# EAGLE design SARduino_328 (EAGLE 5.10)
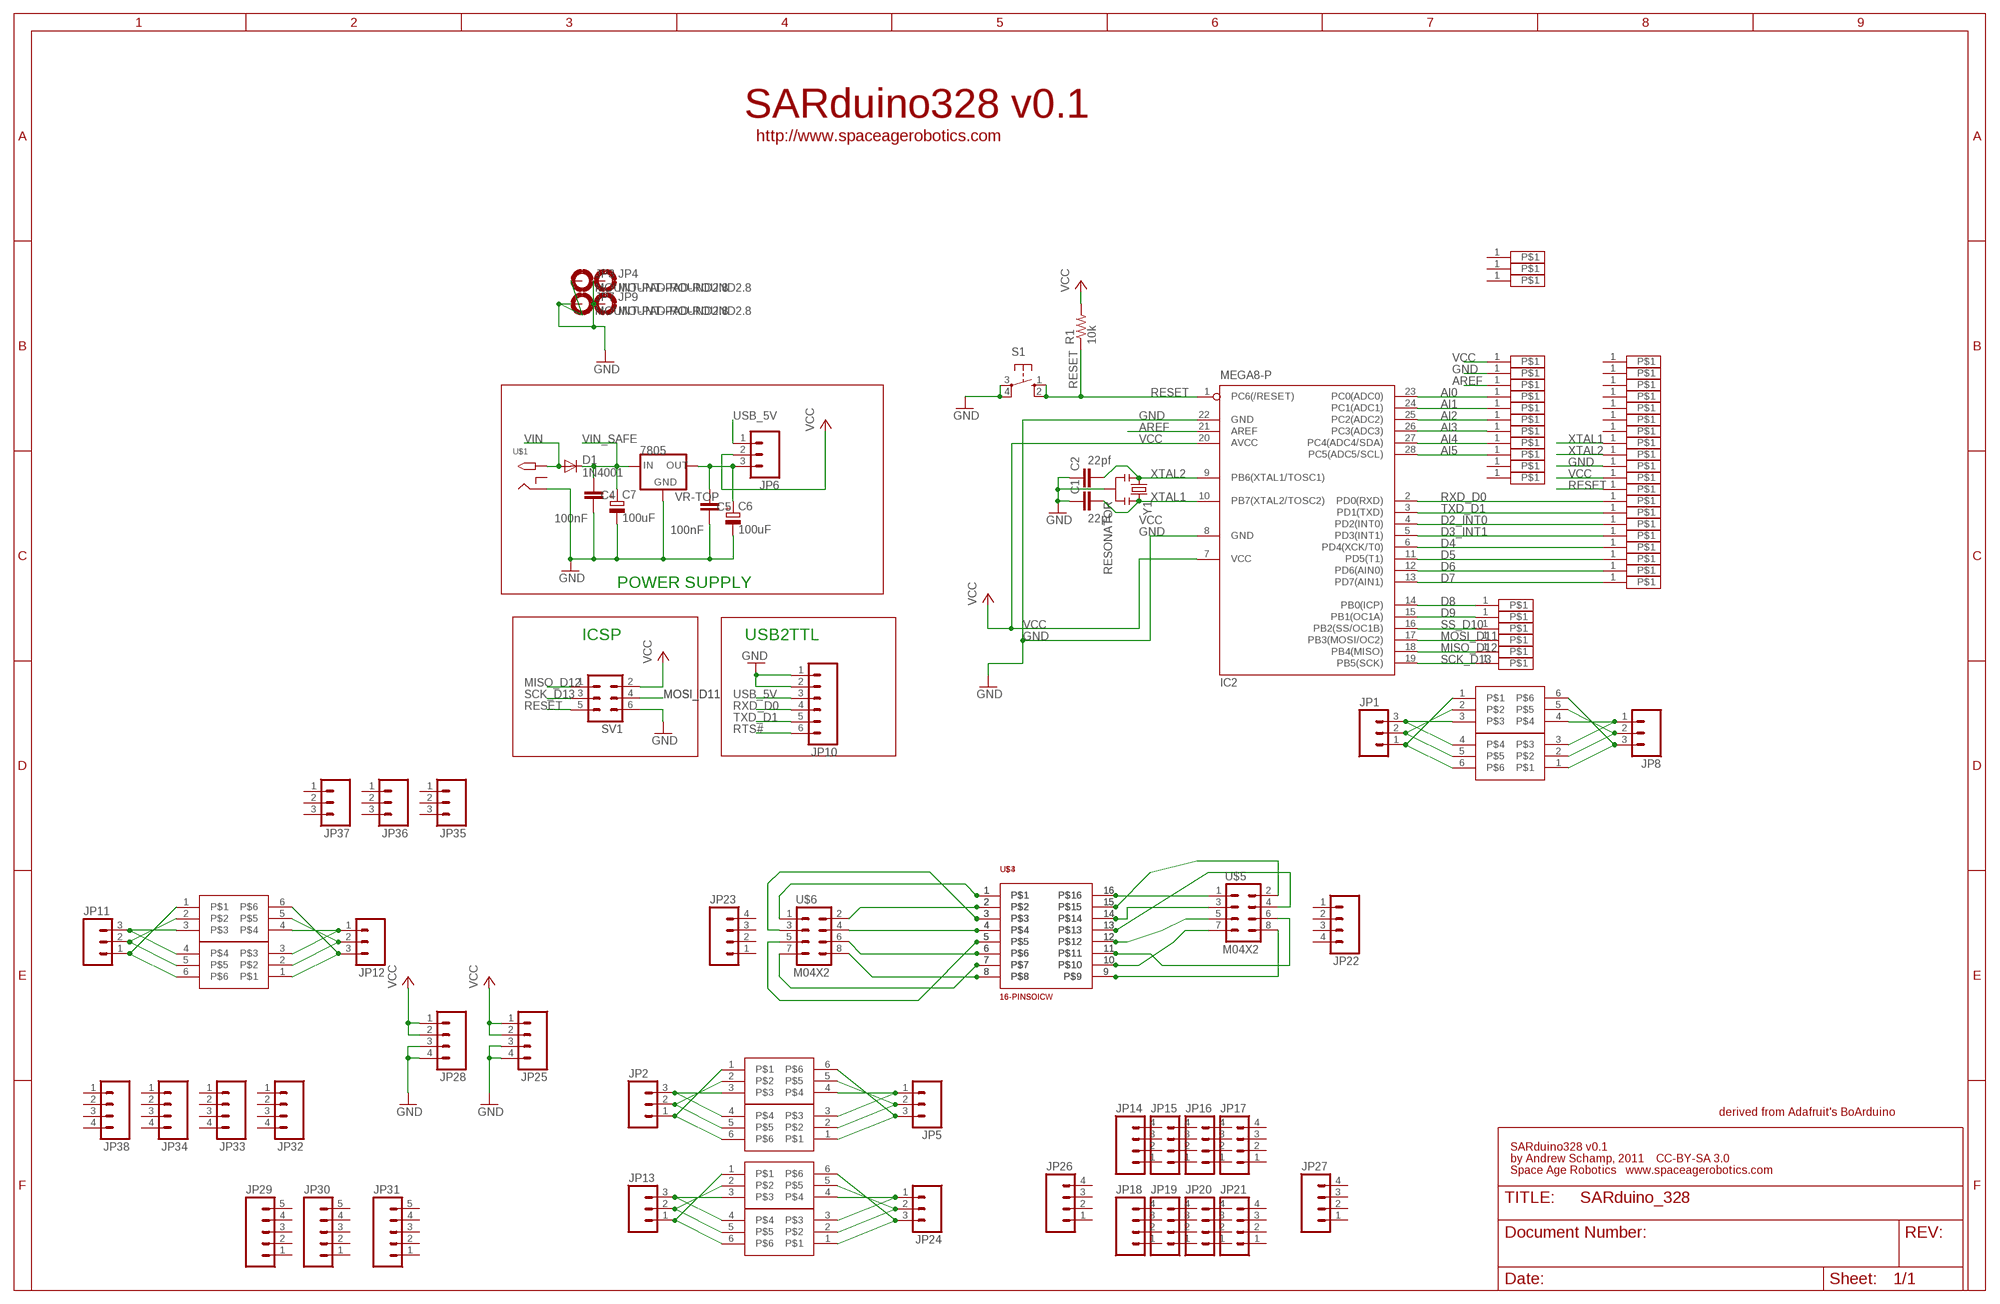
[diagram p0: schematic, sheet 1]

## Parts
C1  22pf  C-EU025-025X050  [C025-025X050]
C2  22pf  C-EU025-025X050  [C025-025X050]
C4  100nF  CAPPTH  [CAP-PTH-SMALL]
C5  100nF  CAPPTH  [CAP-PTH-SMALL]
C6  100uF  CPOL-EUE2.5-6  [E2,5-6]
C7  100uF  CPOL-EUE2.5-6  [E2,5-6]
D1  1N4001  1N4004  [DO41-10]
IC2  MEGA8-P  [DIL28-3]
JP1  M03PTH  [1X03]
JP2  M03PTH  [1X03]
JP3  MOUNT-PAD-ROUND2.8  [2,8-PAD]
JP4  MOUNT-PAD-ROUND2.8  [2,8-PAD]
JP5  M03PTH  [1X03]
JP6  M03PTH  [1X03]
JP7  MOUNT-PAD-ROUND2.8  [2,8-PAD]
JP8  M03PTH  [1X03]
JP9  MOUNT-PAD-ROUND2.8  [2,8-PAD]
JP10  M06LOCK  [1X06_LOCK]
JP11  M03PTH  [1X03]
JP12  M03PTH  [1X03]
JP13  M03PTH  [1X03]
JP14  M04PTH  [1X04]
JP15  M04PTH  [1X04]
JP16  M04PTH  [1X04]
JP17  M04PTH  [1X04]
JP18  M04PTH  [1X04]
JP19  M04PTH  [1X04]
JP20  M04PTH  [1X04]
JP21  M04PTH  [1X04]
JP22  M04PTH  [1X04]
JP23  M04PTH  [1X04]
JP24  M03PTH  [1X03]
JP25  M04PTH  [1X04]
JP26  M04PTH  [1X04]
JP27  M04PTH  [1X04]
JP28  M04PTH  [1X04]
JP29  M05PTH  [1X05]
JP30  M05PTH  [1X05]
JP31  M05PTH  [1X05]
JP32  M04PTH  [1X04]
JP33  M04PTH  [1X04]
JP34  M04PTH  [1X04]
JP35  M03PTH  [1X03]
JP36  M03PTH  [1X03]
JP37  M03PTH  [1X03]
JP38  M04PTH  [1X04]
R1  10k  R-US_0207/2V  [0207/2V]
S1  10-XX  [B3F-10XX]
SV1  ML6  [ML6]
U$1  2.1MMJACKTHM  [PJ-102A]
U$2  3-PIN-STRIP  [1X03-STRIP]
U$3  16-PINSOICW  [SO16W]
U$4  16-PINSOIC  [SO16]
U$5  M04X2  [2X4]
U$6  M04X2  [2X4]
U$7  6-PINSOT23-6  [SOT23-6L]
U$8  6-PINSC70-6  [SC70-6L]
U$9  3-PIN-STRIP  [1X03-STRIP]
U$10  3-PIN-STRIP  [1X03-STRIP]
U$11  3-PIN-STRIP  [1X03-STRIP]
U$12  3-PIN-STRIP  [1X03-STRIP]
U$13  3-PIN-STRIP  [1X03-STRIP]
U$14  3-PIN-STRIP  [1X03-STRIP]
U$15  3-PIN-STRIP  [1X03-STRIP]
U$16  3-PIN-STRIP  [1X03-STRIP]
U$17  3-PIN-STRIP  [1X03-STRIP]
U$18  3-PIN-STRIP  [1X03-STRIP]
U$19  3-PIN-STRIP  [1X03-STRIP]
U$20  3-PIN-STRIP  [1X03-STRIP]
U$21  3-PIN-STRIP  [1X03-STRIP]
U$22  3-PIN-STRIP  [1X03-STRIP]
U$23  3-PIN-STRIP  [1X03-STRIP]
U$24  3-PIN-STRIP  [1X03-STRIP]
U$25  3-PIN-STRIP  [1X03-STRIP]
U$26  3-PIN-STRIP  [1X03-STRIP]
U$27  3-PIN-STRIP  [1X03-STRIP]
U$28  3-PIN-STRIP  [1X03-STRIP]
U$29  3-PIN-STRIP  [1X03-STRIP]
U$30  3-PIN-STRIP  [1X03-STRIP]
U$31  3-PIN-STRIP  [1X03-STRIP]
U$32  3-PIN-STRIP  [1X03-STRIP]
U$33  3-PIN-STRIP  [1X03-STRIP]
U$34  3-PIN-STRIP  [1X03-STRIP]
U$35  3-PIN-STRIP  [1X03-STRIP]
U$36  3-PIN-STRIP  [1X03-STRIP]
U$37  3-PIN-STRIP  [1X03-STRIP]
U$38  3-PIN-STRIP  [1X03-STRIP]
U$39  3-PIN-STRIP  [1X03-STRIP]
U$40  3-PIN-STRIP  [1X03-STRIP]
U$41  3-PIN-STRIP  [1X03-STRIP]
U$42  3-PIN-STRIP  [1X03-STRIP]
U$43  3-PIN-STRIP  [1X03-STRIP]
U$44  3-PIN-STRIP  [1X03-STRIP]
U$45  3-PIN-STRIP  [1X03-STRIP]
U$46  3-PIN-STRIP  [1X03-STRIP]
U$47  3-PIN-STRIP  [1X03-STRIP]
U$48  6-PINSOT23-6  [SOT23-6L]
U$49  6-PINSC70-6  [SC70-6L]
U$50  6-PINSC70-6  [SC70-6L]
U$51  6-PINSC70-6  [SC70-6L]
U$52  6-PINSOT23-6  [SOT23-6L]
U$53  6-PINSOT23-6  [SOT23-6L]
VR-TOP  7805  V_REG_78XXSINK  [TO220-IGO]
Y1  RESONATOR  [RESONATOR/CRYSTAL_COMBO]

## Nets
AI0: IC2.23(PC0(ADC0)) U$15.1
AI1: IC2.24(PC1(ADC1)) U$14.1
AI2: IC2.25(PC2(ADC2)) U$13.1
AI3: IC2.26(PC3(ADC3)) U$12.1
AI4: IC2.27(PC4(ADC4/SDA)) U$10.1
AI5: IC2.28(PC5(ADC5/SCL)) U$11.1
AREF: IC2.21(AREF) U$16.1
D2_INT0: IC2.4(PD2(INT0)) U$42.1
D3_INT1: IC2.5(PD3(INT1)) U$43.1
D4: IC2.6(PD4(XCK/T0)) U$44.1
D5: IC2.11(PD5(T1)) U$45.1
D6: IC2.12(PD6(AIN0)) U$46.1
D7: IC2.13(PD7(AIN1)) U$47.1
D8: IC2.14(PB0(ICP)) U$19.1
D9: IC2.15(PB1(OC1A)) U$21.1
GND: C1.1 C2.1 C4.2 C5.2 C6.- C7.- IC2.8(GND) IC2.22(GND) JP3.B2,8(MOUNT) JP4.B2,8(MOUNT) JP7.B2,8(MOUNT) JP9.B2,8(MOUNT) JP10.1 JP10.2 JP25.3 JP25.4 JP28.3 JP28.4 S1.3(P) S1.4(P1) SV1.6 U$1.RING U$17.1 U$37.1 VR-TOP.GND Y1.2
MISO_D12: IC2.18(PB4(MISO)) SV1.1 U$20.1
MOSI_D11: IC2.17(PB3(MOSI/OC2)) SV1.4 U$25.1
N$1: JP1.3 U$8.4 U$49.3
N$2: JP1.2 U$8.5 U$49.2
N$3: JP1.1 U$8.6 U$49.1
N$4: JP2.3 U$7.3 U$48.4
N$5: JP2.2 U$7.2 U$48.5
N$6: JP2.1 U$7.1 U$48.6
N$7: JP5.1 U$7.4 U$48.3
N$8: JP5.2 U$7.5 U$48.2
N$9: JP5.3 U$7.6 U$48.1
N$10: JP8.1 U$8.3 U$49.4
N$11: U$3.16 U$4.16 U$5.1
N$12: U$3.15 U$4.15 U$5.2
N$13: JP8.2 U$8.2 U$49.5
N$14: U$3.5 U$4.5 U$6.5
N$15: U$3.1 U$4.1 U$6.1
N$16: JP8.3 U$8.1 U$49.6
N$17: JP11.3 U$50.4 U$51.3
N$18: JP11.2 U$50.5 U$51.2
N$19: JP11.1 U$50.6 U$51.1
N$20: JP12.1 U$50.3 U$51.4
N$21: U$3.14 U$4.14 U$5.3
N$22: U$3.13 U$4.13 U$5.4
N$23: U$3.12 U$4.12 U$5.5
N$24: U$3.11 U$4.11 U$5.6
N$25: U$3.10 U$4.10 U$5.7
N$26: U$3.9 U$4.9 U$5.8
N$27: U$3.8 U$4.8 U$6.8
N$28: U$3.7 U$4.7 U$6.7
N$29: U$3.6 U$4.6 U$6.6
N$30: JP12.2 U$50.2 U$51.5
N$31: U$3.4 U$4.4 U$6.4
N$32: U$3.3 U$4.3 U$6.3
N$33: U$3.2 U$4.2 U$6.2
N$34: JP12.3 U$50.1 U$51.6
N$35: JP13.3 U$52.3 U$53.4
N$36: JP13.2 U$52.2 U$53.5
N$37: JP13.1 U$52.1 U$53.6
N$38: JP24.1 U$52.4 U$53.3
N$39: JP24.2 U$52.5 U$53.2
N$40: JP24.3 U$52.6 U$53.1
RESET: IC2.1(PC6(/RESET)) R1.1 S1.1(S) S1.2(S1) SV1.5 U$39.1
RTS#: JP10.6
RXD_D0: IC2.2(PD0(RXD)) JP10.4 U$40.1
SCK_D13: IC2.19(PB5(SCK)) SV1.3 U$23.1
SS_D10: IC2.16(PB2(SS/OC1B)) U$22.1
TXD_D1: IC2.3(PD1(TXD)) JP10.5 U$41.1
USB_5V: JP6.1 JP10.3
VCC [power]: IC2.7(VCC) IC2.20(AVCC) JP6.2 JP25.1 JP25.2 JP28.1 JP28.2 R1.2 SV1.2 U$18.1 U$38.1
VIN [power]: D1.A U$1.TIP
VIN_SAFE [power]: C4.1 C7.+ D1.C VR-TOP.IN
VREG-OUT: C5.1 C6.+ JP6.3 VR-TOP.OUT
XTAL1: C1.2 IC2.10(PB7(XTAL2/TOSC2)) U$35.1 Y1.3
XTAL2: C2.2 IC2.9(PB6(XTAL1/TOSC1)) U$36.1 Y1.1
Unconnected: JP14.1 JP14.2 JP14.3 JP14.4 JP15.1 JP15.2 JP15.3 JP15.4 JP16.1 JP16.2 JP16.3 JP16.4 JP17.1 JP17.2 JP17.3 JP17.4 JP18.1 JP18.2 JP18.3 JP18.4 JP19.1 JP19.2 JP19.3 JP19.4 JP20.1 JP20.2 JP20.3 JP20.4 JP21.1 JP21.2 JP21.3 JP21.4 JP22.1 JP22.2 JP22.3 JP22.4 JP23.1 JP23.2 JP23.3 JP23.4 JP26.1 JP26.2 JP26.3 JP26.4 JP27.1 JP27.2 JP27.3 JP27.4 JP29.1 JP29.2 JP29.3 JP29.4 JP29.5 JP30.1 JP30.2 JP30.3 JP30.4 JP30.5 JP31.1 JP31.2 JP31.3 JP31.4 JP31.5 JP32.1 JP32.2 JP32.3 JP32.4 JP33.1 JP33.2 JP33.3 JP33.4 JP34.1 JP34.2 JP34.3 JP34.4 JP35.1 JP35.2 JP35.3 JP36.1 JP36.2 JP36.3 JP37.1 JP37.2 JP37.3 JP38.1 JP38.2 JP38.3 JP38.4 U$1.RING_SW U$2.1 U$9.1 U$24.1 U$26.1 U$27.1 U$28.1 U$29.1 U$30.1 U$31.1 U$32.1 U$33.1 U$34.1

## Notes on the sheet
- SARduino328 v0.1
- http://www.spaceagerobotics.com
- POWER SUPPLY
- ICSP | USB2TTL
- derived from Adafruit's BoArduino
- SARduino328 v0.1
- by Andrew Schamp, 2011    CC-BY-SA 3.0
- Space Age Robotics   www.spaceagerobotics.com

## Library data of the parts
C1 C2 = rcl:C-EU: CAPACITOR, European symbol
C4 C5 = ideabot:CAP: Capacitor Standard 0603 ceramic capacitor, and 0.1" leaded capacitor.
C6 C7 = rcl:CPOL-EU: POLARIZED CAPACITOR, European symbol
D1 = diode:1N4004: DIODE general purpose rectifier, 1 A
IC2 = atmel:MEGA8-P: MICROCONTROLLER 8 Kbytes FLASH, 1 kbytes SRAM, 512 bytes EEPROM, USART, 4-channel 10 bit ADC, 2-channel 8 bit ADC Pin compatible with Atmega48, ATMega88, ATMega168 Source: avr.lbr
JP1 JP2 JP5 JP6 JP8 JP11-JP13 JP24 JP35-JP37 = SparkFun:M03: Header 3 Standard 3-pin 0.1" header. Use with straight break away headers (SKU : PRT-00116), right angle break away headers (PRT-00553), swiss pins (PRT-00743), machine pins (PRT-00117), and female headers (PRT-00115). Molex polarized connector foot print use with SKU : PRT-08232 with associated crimp pins and housings.
JP3 JP4 JP7 JP9 = holes:MOUNT-PAD-ROUND: MOUNTING PAD, round
JP10 = SparkFun:M06: Header 6 Standard 6-pin 0.1" header. Use with straight break away headers (SKU : PRT-00116), right angle break away headers (PRT-00553), swiss pins (PRT-00743), machine pins (PRT-00117), and female headers (PRT-00115). Molex polarized connector foot print use with SKU : PRT-08094 with associated crimp pins and housings. NOTES ON THE VARIANTS LOCK and LOCK_LONGPADS... This footprint was designed to help hold the alignment of a through-hole component (i.e. 6-pin header) while soldering it into place. You may notice that each hole has been shifted either up or down by 0.005 of an inch from it's more standard position (which is a perfectly straight line). This slight alteration caused the pins (the squares in the middle) to touch the edges of the holes. Because they are alternating, it causes a "brace" to hold the component in place. 0.005 has proven to be the perfect amount of "off-center" position when using our standard breakaway headers. Although looks a little odd when you look at the bare footprint, once you have a header in there, the alteration is very hard to notice. Also, if you push a header all the way into place, it is covered up entirely on the bottom side. This idea of altering the position of holes to aid alignment will be further integrated into the Sparkfun Library for other footprints. It can help hold any component with 3 or more connection pins.
JP14-JP23 JP25-JP28 JP32-JP34 JP38 = SparkFun:M04: Header 4 Standard 4-pin 0.1" header. Use with straight break away headers (SKU : PRT-00116), right angle break away headers (PRT-00553), swiss pins (PRT-00743), machine pins (PRT-00117), and female headers (PRT-00115). Molex polarized connector foot print use with SKU : PRT-08231 with associated crimp pins and housings. 1MM SMD Version SKU: PRT-10208
JP29-JP31 = SparkFun:M05: Header 5 Standard 5-pin 0.1" header. Use with straight break away headers (SKU : PRT-00116), right angle break away headers (PRT-00553), swiss pins (PRT-00743), machine pins (PRT-00117), and female headers (PRT-00115). Molex polarized connector foot print use with SKU : PRT-08230 with associated crimp pins and housings.
R1 = adafruit:R-US_: RESISTOR, American symbol
S1 = switch-omron:10-XX: OMRON SWITCH
SV1 = con-harting-ml:ML6: HARTING
U$1 = adafruit:2.1MMJACK: 2.1mm x 5.5mm THM DC jack with internal switch. Digikey part #PJ-102A, 4UCON part #05537 2.1mm x 5.5mm SMT DC jack with internal switch. Digikey part #PJ-002A-SMT, 4UCON part #03267 By microbuilder.eu & adafruit.com
U$2 U$9-U$47 = ideabot:3-PIN-STRIP
U$3 U$4 = ideabot:16-PIN
U$5 U$6 = SparkFun:M04X2
U$7 U$8 U$48-U$53 = ideabot:6-PIN
VR-TOP = SparkFun:V_REG_78XX: Voltage Regulator Standard 7805 5V regulator. IGO (Input Ground Output). Spark Fun Electronics SKU : COM-00107
Y1 = ideabot:RESONATOR: Resonator Small SMD resonator. This is the itty bitty 10/20MHz resonators with built in caps. CSTCE10M0G55 and CSTCE20M0V53. Footprint has been reviewed closely but hasn't been tested yet.

## Net classes
0 default: width 0.254 mm, clearance 0.152 mm
1 power: width 0.305 mm, clearance 0.152 mm

## Board
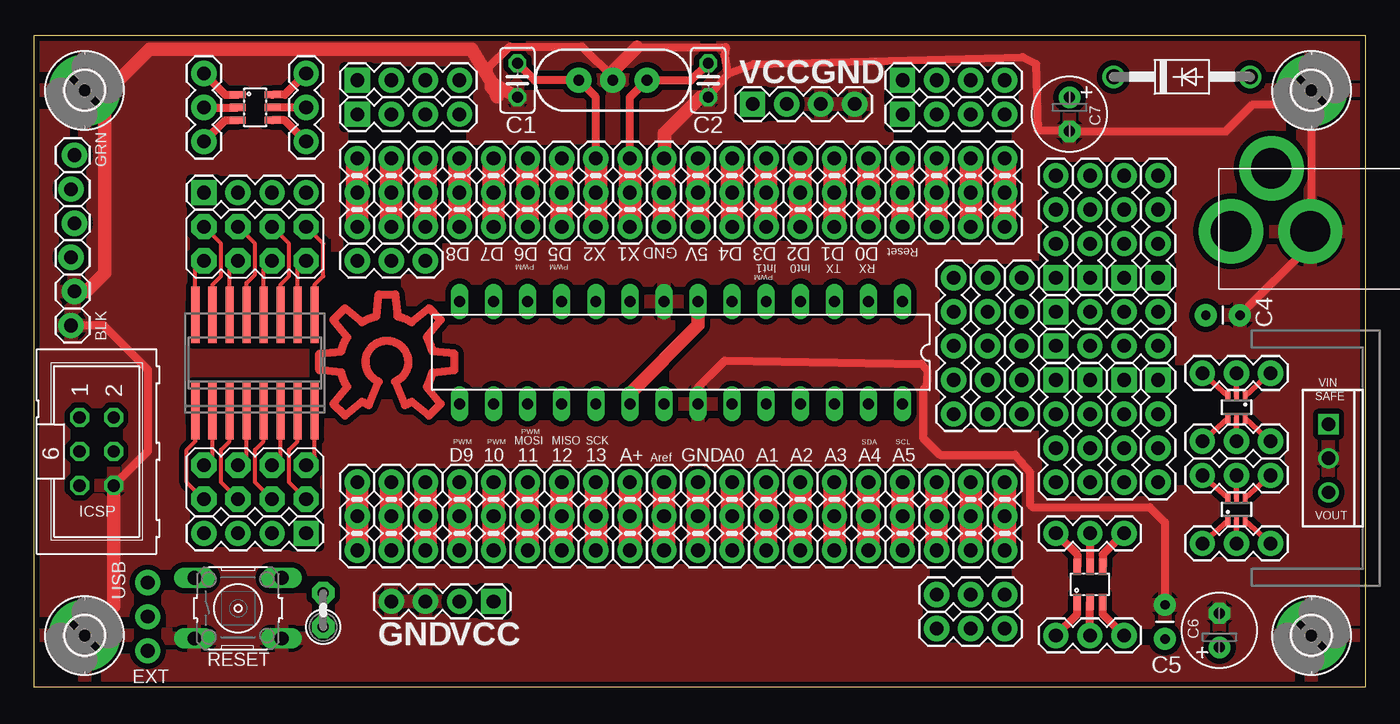
[diagram p1: board, top side]
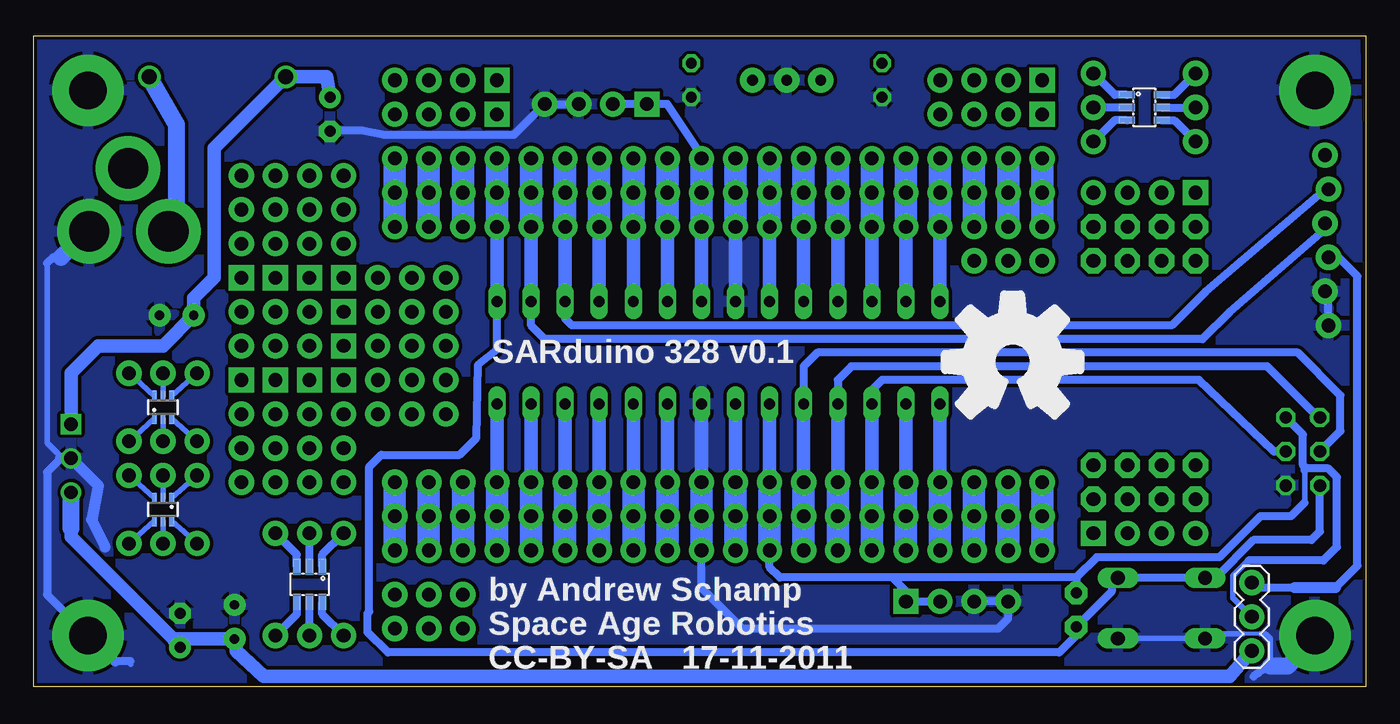
[diagram p2: board, bottom side, seen from below]

Size 99.31 x 48.51 mm. Coordinates in mm from the lower left corner, seen from the top.
Outline: 0,0 99.31,0 99.31,48.51 0,48.51 0,0
Copper layers (1*16): Top 0.035mm / dielectric 1.5mm / Bottom 0.035mm
Design rules "ITead_rule": minimum track width 6mil, minimum drill 12mil, track to track 6mil, track to pad 6mil, pad to pad 6mil, via to via 6mil, smd to smd 0mil, copper to edge 10mil, drill to drill 10mil, minimum pad ring 10mil, minimum via ring 6mil, stop-mask expansion 2mil, vias tented up to drill 100mil, thermal gap 10mil

### Footprints (pad centres in the part's own frame; a part is rotated, then mirrored left to right if it is on the bottom)
C025-025X050 = drill 0.813 octagon: 1 -1.27,0; 2 1.27,0
CAP-PTH-SMALL = drill 0.7 pad 1.651 round: 1 0,0; 2 2.54,0
E2,5-6 = drill 0.813 pad 1.6 round: + -1.27,0 | drill 0.813 pad 1.6 octagon: - 1.27,0
DO41-10 = drill 1.118 round: A 5.08,0; C -5.08,0
DIL28-3 = drill 0.813 long: 1 -16.51,-3.81; 2 -13.97,-3.81; 3 -11.43,-3.81; 4 -8.89,-3.81; 5 -6.35,-3.81; 6 -3.81,-3.81; 7 -1.27,-3.81; 8 1.27,-3.81; 9 3.81,-3.81; 10 6.35,-3.81; 11 8.89,-3.81; 12 11.43,-3.81; 13 13.97,-3.81; 14 16.51,-3.81; 15 16.51,3.81; 16 13.97,3.81; 17 11.43,3.81; 18 8.89,3.81; 19 6.35,3.81; 20 3.81,3.81; 21 1.27,3.81; 22 -1.27,3.81; 23 -3.81,3.81; 24 -6.35,3.81; 25 -8.89,3.81; 26 -11.43,3.81; 27 -13.97,3.81; 28 -16.51,3.81
1X03 = drill 1.016 pad 1.88 round: 1 0,0; 2 2.54,0; 3 5.08,0
2,8-PAD = drill 2.8 pad 5.334 round: B2,8 0,0
1X06_LOCK = drill 1.016 pad 1.88 round: 1 0,0; 2 2.54,-0.254; 3 5.08,0; 4 7.62,-0.254; 5 10.16,0; 6 12.7,-0.254
1X04 = drill 1.016 pad 1.88 square: 1 0,0 | drill 1.016 pad 1.88 round: 2 2.54,0; 3 5.08,0; 4 7.62,0
1X05 = drill 1.016 pad 1.88 round: 1 0,0; 2 2.54,0; 3 5.08,0; 4 7.62,0; 5 10.16,0
0207/2V = drill 0.813 pad 1.676 octagon: 1 -1.27,0; 2 1.27,0
B3F-10XX = drill 1.016 long: 1 -3.251,2.261; 2 3.251,2.261; 3 -3.251,-2.261; 4 3.251,-2.261
ML6 = drill 0.914 octagon: 1 -2.54,-1.27; 2 -2.54,1.27; 3 0,-1.27; 4 0,1.27; 5 2.54,-1.27; 6 2.54,1.27
PJ-102A = drill 3 pad 4.8 round: RING 0.1,-3.39; RING_SW -4.6,-6.29; TIP 0.1,-9.29
1X03-STRIP = drill 1.016 pad 1.88 round: 1 0,0; 2 2.54,0; 3 5.08,0
SO16W = smd 0.6 x 2.2: 1 -4.445,-4.6; 2 -3.175,-4.6; 3 -1.905,-4.6; 4 -0.635,-4.6; 5 0.635,-4.6; 6 1.905,-4.6; 7 3.175,-4.6; 8 4.445,-4.6; 9 4.445,4.6; 10 3.175,4.6; 11 1.905,4.6; 12 0.635,4.6; 13 -0.635,4.6; 14 -1.905,4.6; 15 -3.175,4.6; 16 -4.445,4.6
SO16 = smd 0.6 x 2.2: 1 -4.445,-2.6; 2 -3.175,-2.6; 3 -1.905,-2.6; 4 -0.635,-2.6; 5 0.635,-2.6; 6 1.905,-2.6; 7 3.175,-2.6; 8 4.445,-2.6; 9 4.445,2.6; 10 3.175,2.6; 11 1.905,2.6; 12 0.635,2.6; 13 -0.635,2.6; 14 -1.905,2.6; 15 -3.175,2.6; 16 -4.445,2.6
2X4 = drill 1.016 pad 1.88 octagon: 1 -3.81,-1.27; 2 -3.81,1.27; 3 -1.27,-1.27; 4 -1.27,1.27; 5 1.27,-1.27; 6 1.27,1.27; 7 3.81,-1.27; 8 3.81,1.27
SOT23-6L = smd 0.55 x 1.2: 1 -0.95,-1.3; 2 0,-1.3; 3 0.95,-1.3; 4 0.95,1.3; 5 0,1.3; 6 -0.95,1.3
SC70-6L = smd 0.35 x 0.8: 1 -0.65,-0.85; 2 0,-0.85; 3 0.65,-0.85; 4 0.65,0.85; 5 0,0.85; 6 -0.65,0.85
TO220-IGO = drill 1 round: GND 0,0; OUT 2.54,0 | drill 1 square: IN -2.54,0
RESONATOR/CRYSTAL_COMBO = drill 0.8 pad 1.88 round: 1 -2.54,0; 2 0,0; 3 2.54,0

### Placement (x,y rotation side)
C1  36.07,45.21 90 top
C2  50.29,45.21 90 top
C4  87.38,27.69 0 top
C5  84.33,3.56 90 top
C6  88.39,4.19 90 top
C7  77.22,42.67 270 top
D1  85.6,45.47 0 top
IC2  48.26,24.89 180 top
JP1  87.12,15.75 0 top
JP2  20.32,45.72 270 top
JP3  3.81,3.81 0 top
JP4  95.25,3.81 0 top
JP5  12.7,40.64 90 top
JP6  8.51,7.75 270 bottom
JP7  3.81,44.45 0 top
JP8  92.2,10.67 180 top
JP9  95.25,44.45 0 top
JP10  2.79,26.92 90 top
JP11  92.2,18.29 180 top
JP12  87.12,23.37 0 top
JP13  76.2,11.43 0 top
JP14  76.2,30.48 90 top
JP15  78.74,30.48 90 top
JP16  81.28,30.48 90 top
JP17  83.82,30.48 90 top
JP18  76.2,22.86 270 top
JP19  78.74,22.86 270 top
JP20  81.28,22.86 270 top
JP21  83.82,22.86 270 top
JP22  12.7,36.83 0 top
JP23  20.32,11.43 180 top
JP24  81.28,3.81 180 top
JP25  34.29,6.35 180 top
JP26  76.2,27.94 0 top
JP27  76.2,25.4 0 top
JP28  53.59,43.43 0 top
JP29  73.66,20.32 90 top
JP30  71.12,20.32 90 top
JP31  68.58,20.32 90 top
JP32  24.13,42.67 0 top
JP33  24.13,45.21 0 top
JP34  64.77,42.67 0 top
JP35  67.31,6.86 0 top
JP36  67.31,4.32 0 top
JP37  24.13,31.75 0 top
JP38  64.77,45.21 0 top
R1  21.59,5.71 90 top
S1  15.24,5.84 0 top
SV1  4.7,17.53 270 top
U$1  98.55,34.04 270 top
U$2  24.13,34.29 90 top
U$3  16.51,24.13 0 top
U$4  16.51,24.13 0 top
U$5  16.51,33.02 0 top
U$6  16.51,15.24 0 top
U$7  16.51,43.18 270 bottom
U$8  89.66,13.21 0 top
U$9  26.67,34.29 90 top
U$10  62.23,15.24 270 top
U$11  64.77,15.24 270 top
U$12  59.69,15.24 270 top
U$13  57.15,15.24 270 top
U$14  54.61,15.24 270 top
U$15  52.07,15.24 270 top
U$16  46.99,15.24 270 top
U$17  46.99,34.29 90 top
U$18  49.53,34.29 90 top
U$19  31.75,34.29 90 top
U$20  39.37,15.24 270 top
U$21  31.75,15.24 270 top
U$22  34.29,15.24 270 top
U$23  41.91,15.24 270 top
U$24  72.39,15.24 270 top
U$25  36.83,15.24 270 top
U$26  67.31,34.29 90 top
U$27  69.85,34.29 90 top
U$28  72.39,34.29 90 top
U$29  69.85,15.24 270 top
U$30  67.31,15.24 270 top
U$31  24.13,15.24 270 top
U$32  29.21,34.29 90 top
U$33  29.21,15.24 270 top
U$34  26.67,15.24 270 top
U$35  41.91,34.29 90 top
U$36  44.45,34.29 90 top
U$37  49.53,15.24 270 top
U$38  44.45,15.24 270 top
U$39  64.77,34.29 90 top
U$40  62.23,34.29 90 top
U$41  59.69,34.29 90 top
U$42  57.15,34.29 90 top
U$43  54.61,34.29 90 top
U$44  52.07,34.29 90 top
U$45  39.37,34.29 90 top
U$46  36.83,34.29 90 top
U$47  34.29,34.29 90 top
U$48  16.51,43.18 270 top
U$49  89.66,13.21 180 bottom
U$50  89.66,20.83 180 top
U$51  89.66,20.83 0 bottom
U$52  78.74,7.62 180 bottom
U$53  78.74,7.62 0 top
VR-TOP  96.52,17.02 270 top
Y1  43.18,45.21 180 top

### Tracks (layer width: path | path; a pad name or v marks a point on that pad's centre or on a via)
AI0
  Bottom 1.016: U$15.1 IC2.23
AI1
  Bottom 1.016: U$14.1 IC2.24
AI2
  Bottom 1.016: U$13.1 IC2.25
AI3
  Bottom 1.016: U$12.1 IC2.26
AI4
  Bottom 1.016: U$10.1 IC2.27
AI5
  Bottom 1.016: U$11.1 IC2.28
AREF
  Bottom 1.016: U$16.1 IC2.21
D2_INT0
  Bottom 1.016: IC2.4 U$42.1
D3_INT1
  Bottom 1.016: IC2.5 U$43.1
D4
  Bottom 1.016: IC2.6 U$44.1 52.07,34.8
D5
  Bottom 1.016: IC2.11 U$45.1
D6
  Bottom 1.016: IC2.12 U$46.1
D7
  Bottom 1.016: IC2.13 U$47.1
D8
  Bottom 1.016: IC2.14 U$19.1
D9
  Bottom 1.016: U$21.1 IC2.15
GND
  Top 0.61: JP10.1 5.23,26.92 8.53,23.62 8.53,17.55 SV1.6 | 44.98,47.68 51.61,47.68 51.49,47.04 51.74,45.64 | 51.74,45.64 C2.1 | Y1.2 43.18,45.44 40.89,47.73 35.48,47.73 33.96,46.2 33.96,44.55 34.54,43.97 | 51.74,45.64 53.7,46.41 73.74,46.94 74.73,46.43 74.85,41.48 77.14,41.48 C7.- 88.88,41.4 90.88,43.41 94.21,43.41 JP9.B2,8 95.25,34.02 U$1.RING 95.16,32.93 C4.2 | IC2.22 49.53,22.3 51.54,24.31 66.19,24.05 66.62,23.55 66.55,22.35 66.29,22.1 66.29,18.54 67.56,17.27 73.15,17.27 74.27,15.98 74.27,13.56 74.47,13.36 83.21,13.36 84.33,12.24 C5.2
  Top 1.016: SV1.6 5.97,5.97 JP3.B2,8 | JP10.2 3.94,29.46 5.31,30.84 5.31,42.95 JP7.B2,8 5.59,44.45 8.66,47.52 32.66,47.52 34.19,44.98 | 34.19,44.98 34.54,43.97 | 34.19,44.98 36.04,43.97 C1.1 | C2.1 49.71,43.94 47.02,41.25 47.02,34.31 U$17.1 | Y1.2 43.18,45.87 44.98,47.68
  Bottom 0.305: 7.87,3.94 9.14,3.94
  Bottom 0.406: 8,1.02 7.11,1.4 7.11,1.52 7.11,3.56 7.49,3.94 7.87,3.94 | 9.14,3.94 11.63,3.94 S1.3 S1.4 | 92.08,1.91 92.08,1.65 | 97.16,17.02 97.41,17.02 | 97.16,17.02 VR-TOP.GND | 97.16,17.02 98.3,18.16 98.3,31.56
  Bottom 0.61: 97.28,32 97.86,32 98.3,31.56 | 8,1.02 8.38,0.76 | 92.08,1.91 93.34,1.91 JP4.B2,8 | JP10.1 2.79,29.21 JP10.2 | 97.41,17.02 97.41,16.89 98.3,16 98.3,6.86 JP4.B2,8 | JP4.B2,8 93.22,1.78 | JP25.3 JP25.4 26.67,5.08 27.43,4.32 46.48,4.32 49.53,7.37 U$37.1 | JP28.3 JP28.4 63.5,41.15 73.15,41.15 74.85,41.48 77.14,41.48 C7.-
  Bottom 0.813: 93.98,10.41 95,12.45 94.49,14.99 VR-TOP.GND
  Bottom 1.016: U$37.1 IC2.22 | U$17.1 IC2.8
  Bottom 1.27: JP3.B2,8 3.81,3.56 5.84,1.52 7.11,1.52 | U$1.RING 95.67,33.62 97.28,32
  pour Bottom (isolate 0.254): 0.89,49.66 -0.25,-0.25 99.57,-4.32 99.31,51.31
  pour Top (isolate 0.406): 0.25,-0.25 55.63,-2.03 101.19,-0.76 101.78,51.13 0.71,50.57
MISO_D12
  Bottom 0.61: 3.56,20.07 7.37,23.88 38.35,23.88 39.37,22.86 IC2.18
  Bottom 1.016: IC2.18 U$20.1
  Bottom 1.27: SV1.1 3.56,20.07
MOSI_D11
  Bottom 0.61: SV1.4 6.86,17.53 12.45,22.86 36.07,22.86 36.83,22.1 IC2.17
  Bottom 1.016: IC2.17 U$25.1
N$1
  Top 0.406: JP1.3 U$49.3
  Bottom 0.406: U$49.3 JP1.3
N$2
  Top 0.406: JP1.2 U$49.2
  Bottom 0.406: U$49.2 JP1.2
N$3
  Top 0.406: JP1.1 U$49.1
  Bottom 0.406: U$49.1 JP1.1
N$4
  Top 0.61: U$7.3 18.73,42.23 JP2.3
  Bottom 0.61: U$7.3 18.73,42.23 JP2.3
N$5
  Top 0.61: JP2.2 U$7.2
  Bottom 0.61: U$7.2 JP2.2
N$6
  Top 0.61: U$7.1 18.73,44.13 JP2.1
  Bottom 0.61: U$7.1 18.73,44.13 JP2.1
N$7
  Top 0.61: U$7.4 14.29,42.23 JP5.1
  Bottom 0.61: U$7.4 14.29,42.23 JP5.1
N$8
  Top 0.61: JP5.2 U$7.5
  Bottom 0.61: U$7.5 JP5.2
N$9
  Top 0.61: U$7.6 14.29,44.13 JP5.3
  Bottom 0.61: U$7.6 14.29,44.13 JP5.3
N$10
  Top 0.406: JP8.1 U$49.4
  Bottom 0.406: U$49.4 JP8.1
N$11
  Top 0.305: U$5.1 12.06,31.11 U$3.16
  Top 0.61: U$4.16 U$3.16
N$12
  Top 0.305: U$3.15 13.34,29.97 13.97,30.61 13.97,33.02 U$5.2
  Top 0.61: U$4.15 U$3.15
N$13
  Top 0.406: JP8.2 U$49.5
  Bottom 0.406: U$49.5 JP8.2
N$14
  Top 0.305: U$3.5 17.14,18.29 16.51,17.65 16.51,15.24 U$6.5
  Top 0.61: U$3.5 U$4.5
N$15
  Top 0.305: U$3.1 12.06,18.29 11.43,17.65 11.43,15.24 U$6.1
  Top 0.61: U$3.1 U$4.1
N$16
  Top 0.406: JP8.3 U$49.6
  Bottom 0.406: JP8.3 U$49.6
N$17
  Top 0.406: JP11.3 U$51.3
  Bottom 0.406: JP11.3 U$51.3
N$18
  Top 0.406: JP11.2 U$51.2
  Bottom 0.406: U$51.2 JP11.2
N$19
  Top 0.406: JP11.1 U$51.1
  Bottom 0.406: U$51.1 JP11.1
N$20
  Top 0.406: JP12.1 U$51.4
  Bottom 0.406: U$51.4 JP12.1
N$21
  Top 0.305: U$3.14 14.61,31.11 U$5.3
  Top 0.61: U$4.14 U$3.14
N$22
  Top 0.305: U$5.4 16.51,33.02 16.51,30.73 15.88,30.1 U$3.13
  Top 0.61: U$4.13 U$3.13
N$23
  Top 0.305: U$3.12 17.14,31.11 U$5.5
  Top 0.61: U$4.12 U$3.12
N$24
  Top 0.305: U$5.6 19.05,33.02 19.05,30.61 18.41,29.97 U$3.11
  Top 0.61: U$4.11 U$3.11
N$25
  Top 0.305: U$3.10 19.68,31.11 U$5.7
  Top 0.61: U$4.10 U$3.10
N$26
  Top 0.305: U$5.8 21.59,33.02 21.59,30.61 20.95,29.97 U$3.9
  Top 0.61: U$4.9 U$3.9
N$27
  Top 0.305: U$3.8 20.95,17.14 U$6.8
  Top 0.61: U$3.8 U$4.8
N$28
  Top 0.305: U$3.7 19.68,18.29 19.05,17.65 19.05,15.24 U$6.7
  Top 0.61: U$3.7 U$4.7
N$29
  Top 0.305: U$3.6 18.41,17.14 U$6.6
  Top 0.61: U$3.6 U$4.6
N$30
  Top 0.406: JP12.2 U$51.5
  Bottom 0.406: U$51.5 JP12.2
N$31
  Top 0.305: U$3.4 15.88,17.14 U$6.4
  Top 0.61: U$3.4 U$4.4
N$32
  Top 0.305: U$3.3 14.61,18.29 13.97,17.65 13.97,15.24 U$6.3
  Top 0.61: U$3.3 U$4.3
N$33
  Top 0.305: U$3.2 13.34,17.14 U$6.2
  Top 0.61: U$3.2 U$4.2
N$34
  Top 0.406: JP12.3 U$51.6
  Bottom 0.406: U$51.6 JP12.3
N$35
  Top 0.61: U$52.3 79.69,9.84 JP13.3
  Bottom 0.61: U$52.3 79.69,9.84 JP13.3
N$36
  Top 0.61: JP13.2 U$52.2
  Bottom 0.61: U$52.2 JP13.2
N$37
  Top 0.61: U$52.1 77.79,9.84 JP13.1
  Bottom 0.61: U$52.1 77.79,9.84 JP13.1
N$38
  Top 0.61: U$52.4 79.69,5.4 JP24.1
  Bottom 0.61: U$52.4 79.69,5.4 JP24.1
N$39
  Top 0.61: JP24.2 U$52.5
  Bottom 0.61: JP24.2 U$52.5
N$40
  Top 0.61: U$52.6 77.79,5.4 JP24.3
  Bottom 0.61: U$52.6 77.79,5.4 JP24.3
N$41
  Top 0.61: 27.68,20.98 arc9 28.19,21.24 29.47,20.2 30.34,21.08 29.3,22.36 arc19 29.74,23.42 31.38,23.59 31.38,24.82 29.74,24.99 arc19 29.3,26.06 30.34,27.33 29.47,28.21 28.19,27.17 arc19 27.12,27.61 26.96,29.25 25.72,29.25 25.55,27.61 arc19 24.49,27.17 23.21,28.21 22.34,27.33 23.38,26.06 arc19 22.94,24.99 21.3,24.82 21.3,23.59 22.94,23.42 arc19 23.38,22.36 22.34,21.08 23.21,20.2 24.49,21.24 arc9 25,20.98 25.73,22.74 arc-68 24.75,24.21 arc-248 26.95,22.74 27.68,20.98
RESET
  Bottom 0.406: S1.2 18.95,8.1 | 11.2,8.1 S1.1
  Bottom 0.61: S1.1 S1.2 | 11.2,8.1 8.38,10.92 4.06,10.92 3.43,11.56 SV1.5 | 18.95,8.1 18.95,7.09 R1.1 21.59,3.81 22.86,2.54 72.9,2.54 74.42,4.06 74.42,5.46 74.3,5.59 74.3,16.38 73.41,17.27 67.56,17.27 66.29,18.54 66.17,24 64.77,25.15 IC2.1
  Bottom 1.016: IC2.1 U$39.1
RXD_D0
  Bottom 0.61: JP10.4 2.79,34.29 10.16,27.94 12.19,25.91 61.21,25.91 62.23,26.92 IC2.2
  Bottom 1.016: IC2.2 U$40.1
SCK_D13
  Bottom 0.61: SV1.3 1.91,19.05 1.91,21.72 5.08,24.89 40.89,24.89 41.91,23.88 IC2.19
  Bottom 1.016: IC2.19 U$23.1
SS_D10
  Bottom 1.016: U$22.1 IC2.16
TXD_D1
  Bottom 0.61: JP10.5 3.05,36.83 3.3,36.83 11.94,29.46 14.48,26.92 59.18,26.92 59.69,27.43 IC2.3
  Bottom 1.016: IC2.3 U$41.1
USB_5V
  Bottom 0.406: 8.13,7.37 JP6.1
  Bottom 0.61: 5.33,7.37 8.13,7.37 | 2.29,7.37 0.64,9.02 0.64,30.61 2.03,32 JP10.3
  Bottom 0.813: 2.29,7.37 5.33,7.37
VCC
  Top 1.016: IC2.20 44.45,21.87 49.53,26.95 IC2.7
  Bottom 0.406: 8.76,9.4 9.91,8.26 9.91,6.6 JP6.2 | 4.57,16.13 4.57,13.72
  Bottom 0.61: 4.45,16.26 2.79,16.26 2.16,15.62 2.16,10.41 3.17,9.4 8.76,9.4 | 4.45,16.26 4.7,16.51 4.7,18.8 SV1.2 | 21.59,8.13 R1.2 | 21.59,8.13 20.07,9.65 10.92,9.65 7.87,12.7 5.59,12.7 4.57,13.72 | 4.45,16.26 4.57,16.13 | 21.59,8.13 35.31,8.13 | 35.31,8.13 43.69,8.13 44.45,8.89 44.45,14.73 U$38.1 | JP25.2 JP25.1 34.29,7.11 35.31,8.13 | JP28.2 JP28.1 52.07,43.43 49.53,39.62 U$18.1
  Bottom 1.016: 44.45,14.73 IC2.20 | IC2.7 U$18.1
VIN
  Bottom 1.27: D1.A 88.65,41.91 88.65,35.06 U$1.TIP
VIN_SAFE
  Bottom 1.016: VR-TOP.IN 96.52,23.37 94.49,25.4 89.66,25.4 C4.1 87.38,28.96 85.85,30.48 85.85,40.13 D1.C 77.47,45.47 C7.+
VREG-OUT
  Bottom 1.016: JP6.3 10.16,0.76 82.17,0.76 84.2,2.67 84.2,2.92 C5.1 88.77,3.56 C6.+ 89.03,3.68 96.52,11.18 96.52,11.81
  Bottom 1.27: 96.52,11.81 VR-TOP.OUT
XTAL1
  Top 0.61: U$35.1 41.91,43.94 Y1.3 37.34,45.21 C1.2
  Bottom 1.016: IC2.10 U$35.1
XTAL2
  Top 0.61: U$36.1 44.45,43.94 Y1.1 49.02,45.21 C2.2
  Bottom 1.016: IC2.9 U$36.1

### Text on the board
tPlace: VCC | GND | GRN | D8 | D7 | D6 | D5 | X2 | X1 | GND | 5V | D4 | D3 | D2 | D1 | D0 | Reset | PWM | PWM | PWM | Int1 | Int0 | TX | RX | BLK | VIN | SAFE | PWM | PWM | PWM | MOSI | MISO | SCK | SDA | SCL | D9 | 10 | 11 | 12 | 13 | A+ | Aref | GND | A0 | A1 | A2 | A3 | A4 | A5 | ICSP | VOUT | USB | GND | VCC | RESET | EXT
bPlace: SARduino 328 v0.1 | by Andrew Schamp | Space Age Robotics | CC-BY-SA 17-11-2011